# EAGLE design untitled (EAGLE 6.3)
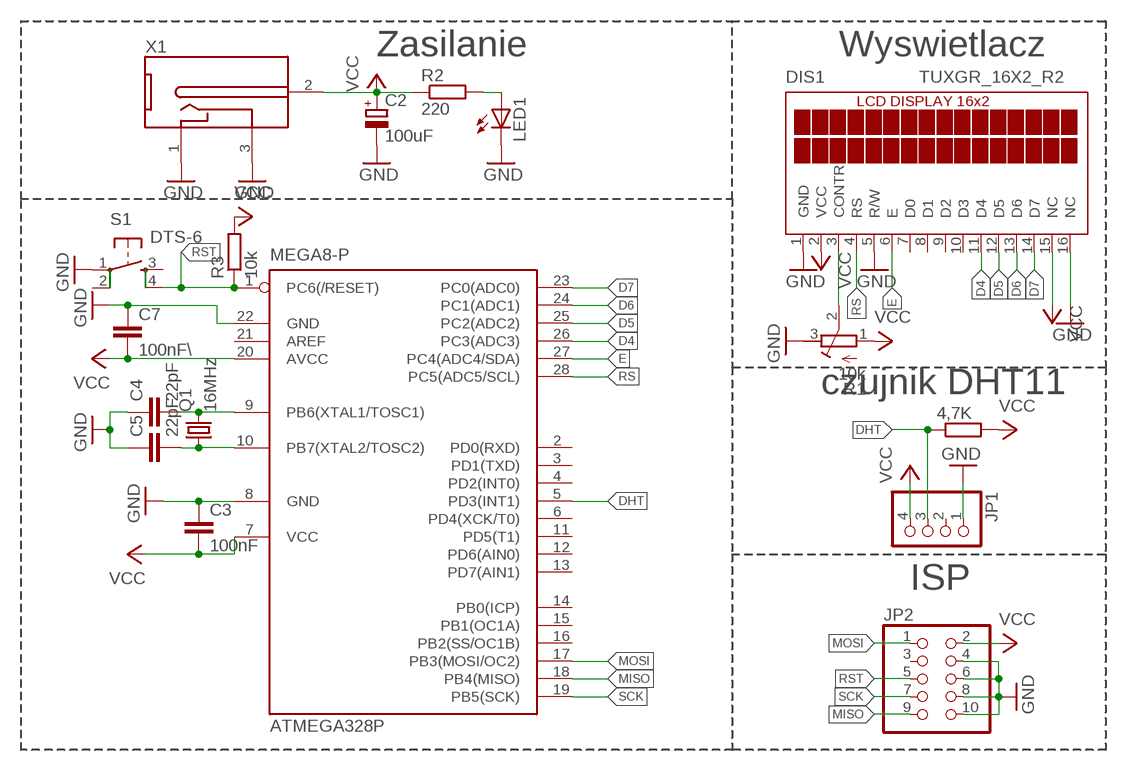
[diagram p0: schematic, sheet 1]

## Parts
4,7K  R-EU_0204/7  [0204/7]
ATMEGA328P  MEGA8-P  [DIL28-3]
C2  100uF  CPOL-EUE2.5-6  [E2,5-6]
C3  100nF  C-EU025-025X050  [C025-025X050]
C4  22pF  C-EU025-025X050  [C025-025X050]
C5  22pF  C-EU025-025X050  [C025-025X050]
C7  100nF\  C-EU025-025X050  [C025-025X050]
DIS1  TUXGR_16X2_R2  [TUXGR_16X2_R2]
JP1  PINHD-1X4  [1X04]
JP2  PINHD-2X5  [2X05]
LED1  LED3MM  [LED3MM]
Q1  16MHz  CRYSTALHC49S  [HC49/S]
R1  10k  R-TRIMM3339P  [RTRIM3339P]
R2  220  R-EU_0204/7  [0204/7]
R3  10k  R-EU_0204/7  [0204/7]
S1  DTS-6  [DTS-6]
X1  DC-2.1MM-5MM  [DC-21MM]

## Nets
D4: ATMEGA328P.26(PC3(ADC3)) DIS1.11(D4)
D5: ATMEGA328P.25(PC2(ADC2)) DIS1.12(D5)
D6: ATMEGA328P.24(PC1(ADC1)) DIS1.13(D6)
D7: ATMEGA328P.23(PC0(ADC0)) DIS1.14(D7)
DHT: 4,7K.1 ATMEGA328P.5(PD3(INT1)) JP1.3
E: ATMEGA328P.27(PC4(ADC4/SDA)) DIS1.6(E)
GND: ATMEGA328P.8(GND) ATMEGA328P.22(GND) C2.- C3.1 C4.1 C5.1 C7.1 DIS1.1(GND) DIS1.5(R/W) DIS1.16(NC) JP1.1 JP2.4 JP2.6 JP2.8 JP2.10 LED1.K(C) R1.3(A) S1.1 X1.1 X1.3
MISO: ATMEGA328P.18(PB4(MISO)) JP2.9
MOSI: ATMEGA328P.17(PB3(MOSI/OC2)) JP2.1
N$3: LED1.A R2.2
N$7: ATMEGA328P.10(PB7(XTAL2/TOSC2)) C5.2 Q1.1
N$8: ATMEGA328P.9(PB6(XTAL1/TOSC1)) C4.2 Q1.2
N$18: DIS1.3(CONTR) R1.2(S)
RS: ATMEGA328P.28(PC5(ADC5/SCL)) DIS1.4(RS)
RST: ATMEGA328P.1(PC6(/RESET)) JP2.5 R3.1 S1.4
SCK: ATMEGA328P.19(PB5(SCK)) JP2.7
VCC: 4,7K.2 ATMEGA328P.7(VCC) ATMEGA328P.20(AVCC) C2.+ C3.2 C7.2 DIS1.2(VCC) DIS1.15(NC) JP1.4 JP2.2 R1.1(E) R2.1 R3.2 X1.2
Unconnected: ATMEGA328P.2(PD0(RXD)) ATMEGA328P.3(PD1(TXD)) ATMEGA328P.4(PD2(INT0)) ATMEGA328P.6(PD4(XCK/T0)) ATMEGA328P.11(PD5(T1)) ATMEGA328P.12(PD6(AIN0)) ATMEGA328P.13(PD7(AIN1)) ATMEGA328P.14(PB0(ICP)) ATMEGA328P.15(PB1(OC1A)) ATMEGA328P.16(PB2(SS/OC1B)) ATMEGA328P.21(AREF) DIS1.7(D0) DIS1.8(D1) DIS1.9(D2) DIS1.10(D3) JP1.2 JP2.3 S1.2 S1.3

## Notes on the sheet
- Zasilanie | Wyswietlacz
- czujnik DHT11
- ISP

## Library data of the parts
4,7K R2 R3 = resistor:R-EU_: RESISTOR, European symbol
ATMEGA328P = atmel:MEGA8-P: MICROCONTROLLER 8 Kbytes FLASH, 1 kbytes SRAM, 512 bytes EEPROM, USART, 4-channel 10 bit ADC, 2-channel 8 bit ADC Pin compatible with Atmega48, ATMega88, ATMega168 Source: avr.lbr
C2 = resistor:CPOL-EU: POLARIZED CAPACITOR, European symbol
C3-C5 C7 = resistor:C-EU: CAPACITOR, European symbol
DIS1 = display-lcd:TUXGR_16X2_R2: Tuxgraphics LCD display 16x2 characters reflective, without background light Source: tuxgr_12x2_r2.pdf; OC_FARNELL: unknown; OC_NEWARK: unknown
JP1 = pinhead:PINHD-1X4: PIN HEADER
JP2 = pinhead:PINHD-2X5: PIN HEADER
LED1 = led:LED: LED OSRAM: - CHIPLED LG R971, LG N971, LY N971, LG Q971, LY Q971, LO R971, LY R971 LH N974, LH R974 LS Q976, LO Q976, LY Q976 LO Q996 - Hyper CHIPLED LW Q18S LB Q993, LB Q99A, LB R99A - SideLED LS A670, LO A670, LY A670, LG A670, LP A670 LB A673, LV A673, LT A673, LW A673 LH A674 LY A675 LS A676, LA A676, LO A676, LY A676, LW A676 LS A679, LY A679, LG A679 - Hyper Micro SIDELED® LS Y876, LA Y876, LO Y876, LY Y876 LT Y87S - SmartLED LW L88C, LW L88S LB L89C, LB L89S, LG L890 LS L89K, LO L89K, LY L89K LS L896, LA L896, LO L896, LY L896 - TOPLED LS T670, LO T670, LY T670, LG T670, LP T670 LSG T670, LSP T670, LSY T670, LOP T670, LYG T670 LG T671, LOG T671, LSG T671 LB T673, LV T673, LT T673, LW T673 LH T674 LS T676, LA T676, LO T676, LY T676, LB T676, LH T676, LSB T676, LW T676 LB T67C, LV T67C, LT T67C, LS T67K, LO T67K, LY T67K, LW E67C LS E67B, LA E67B, LO E67B, LY E67B, LB E67C, LV E67C, LT E67C LW T67C LS T679, LY T679, LG T679 LS T770, LO T770, LY T770, LG T770, LP T770 LB T773, LV T773, LT T773, LW T773 LH T774 LS E675, LA E675, LY E675, LS T675 LS T776, LA T776, LO T776, LY T776, LB T776 LHGB T686 LT T68C, LB T68C - Hyper Mini TOPLED® LB M676 - Mini TOPLED Santana® LG M470 LS M47K, LO M47K, LY M47K Source: http://www.osram.convergy.de LUXEON: - LUMILED® LXK2-PW12-R00, LXK2-PW12-S00, LXK2-PW14-U00, LXK2-PW14-V00 LXK2-PM12-R00, LXK2-PM12-S00, LXK2-PM14-U00 LXK2-PE12-Q00, LXK2-PE12-R00, LXK2-PE12-S00, LXK2-PE14-T00, LXK2-PE14-U00 LXK2-PB12-K00, LXK2-PB12-L00, LXK2-PB12-M00, LXK2-PB14-N00, LXK2-PB14-P00, LXK2-PB14-Q00 LXK2-PR12-L00, LXK2-PR12-M00, LXK2-PR14-Q00, LXK2-PR14-R00 LXK2-PD12-Q00, LXK2-PD12-R00, LXK2-PD12-S00 LXK2-PH12-R00, LXK2-PH12-S00 LXK2-PL12-P00, LXK2-PL12-Q00, LXK2-PL12-R00 Source: www.luxeon.com KINGBRIGHT: KA-3528ASYC Source: www.kingbright.com
Q1 = crystal:CRYSTAL: CRYSTAL; OC_FARNELL: 1667008; OC_NEWARK: unknown
R1 = resistor:R-TRIMM: Trimm resistor
S1 = switch-tact:DTS-6
X1 = power-jack:DC: 5mm x 2.1mm jack

## Board
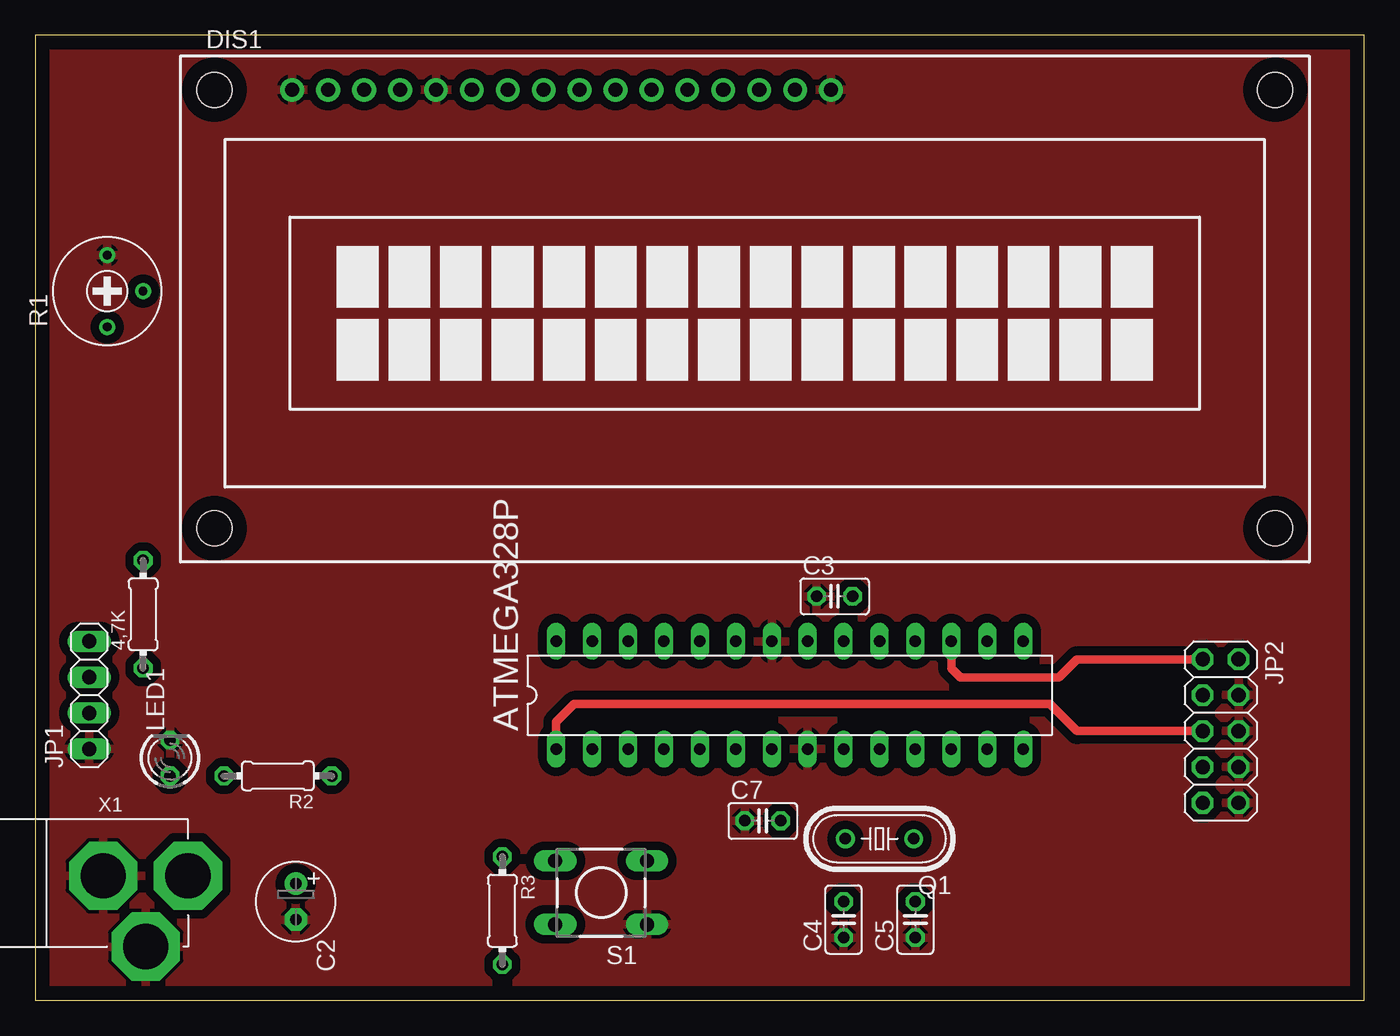
[diagram p1: board, top side]
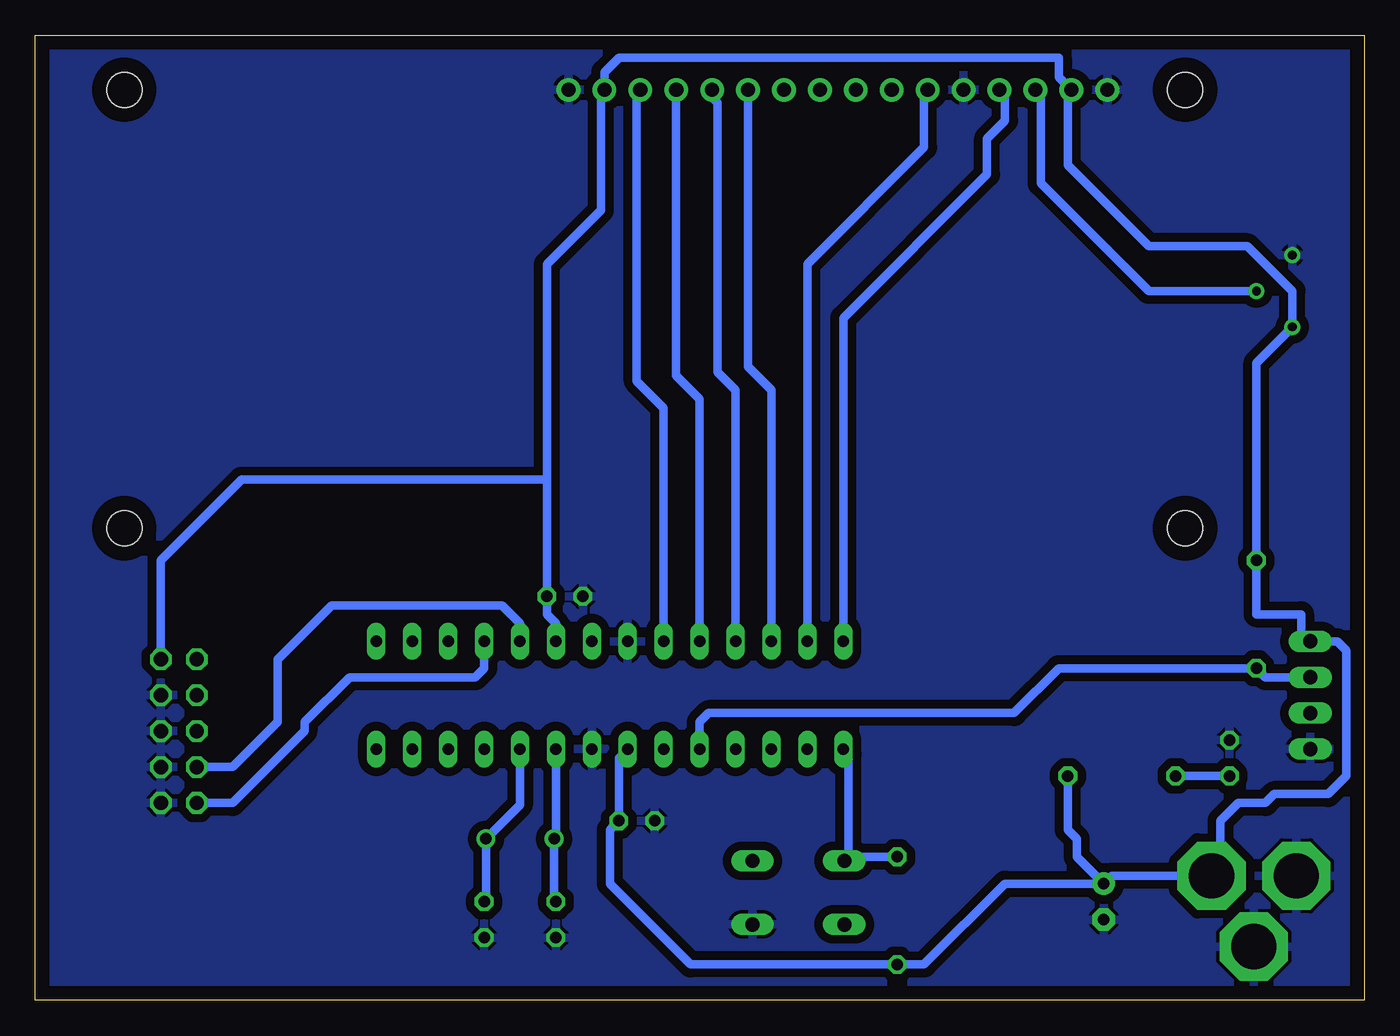
[diagram p2: board, bottom side, seen from below]

Size 93.96 x 68.25 mm. Coordinates in mm from the lower left corner, seen from the top.
Outline: 0,0 93.96,0 93.96,68.25 0,68.25 0,0
Copper layers (1*16): Top 0.035mm / dielectric 1.5mm / Bottom 0.035mm
Design rules "default": minimum track width 10mil, minimum drill 24mil, track to track 8mil, track to pad 8mil, pad to pad 8mil, via to via 8mil, smd to smd 8mil, copper to edge 40mil, drill to drill 8mil, minimum pad ring 10mil, minimum via ring 8mil, stop-mask expansion 4mil, vias tented up to drill 0mil, thermal gap 10mil

### Footprints (pad centres in the part's own frame; a part is rotated, then mirrored left to right if it is on the bottom)
0204/7 = drill 0.813 octagon: 1 -3.81,0; 2 3.81,0
DIL28-3 = drill 0.813 long: 1 -16.51,-3.81; 2 -13.97,-3.81; 3 -11.43,-3.81; 4 -8.89,-3.81; 5 -6.35,-3.81; 6 -3.81,-3.81; 7 -1.27,-3.81; 8 1.27,-3.81; 9 3.81,-3.81; 10 6.35,-3.81; 11 8.89,-3.81; 12 11.43,-3.81; 13 13.97,-3.81; 14 16.51,-3.81; 15 16.51,3.81; 16 13.97,3.81; 17 11.43,3.81; 18 8.89,3.81; 19 6.35,3.81; 20 3.81,3.81; 21 1.27,3.81; 22 -1.27,3.81; 23 -3.81,3.81; 24 -6.35,3.81; 25 -8.89,3.81; 26 -11.43,3.81; 27 -13.97,3.81; 28 -16.51,3.81
E2,5-6 = drill 0.813 pad 1.6: + -1.27,0 | drill 0.813 pad 1.6 octagon: - 1.27,0
C025-025X050 = drill 0.813 octagon: 1 -1.27,0; 2 1.27,0
TUXGR_16X2_R2 = drill 1 pad 1.676: 1 -32,15.5; 2 -29.46,15.5; 3 -26.92,15.5; 4 -24.38,15.5; 5 -21.84,15.5; 6 -19.3,15.5; 7 -16.76,15.5; 8 -14.22,15.5; 9 -11.68,15.5; 10 -9.14,15.5; 11 -6.6,15.5; 12 -4.06,15.5; 13 -1.52,15.5; 14 1.02,15.5; 15 3.56,15.5; 16 6.1,15.5 | hole 2.5: -37.5,-15.5; 37.5,-15.5; -37.5,15.5; 37.5,15.5
1X04 = drill 1.016 long: 1 -3.81,0; 2 -1.27,0; 3 1.27,0; 4 3.81,0
2X05 = drill 1.016 octagon: 1 -5.08,-1.27; 2 -5.08,1.27; 3 -2.54,-1.27; 4 -2.54,1.27; 5 0,-1.27; 6 0,1.27; 7 2.54,-1.27; 8 2.54,1.27; 9 5.08,-1.27; 10 5.08,1.27
LED3MM = drill 0.813 octagon: A -1.27,0; K 1.27,0
HC49/S = drill 0.813: 1 -2.413,0; 2 2.413,0
RTRIM3339P = drill 0.61: 1 -2.54,0; 2 0,-2.54; 3 2.54,0
DTS-6 = drill 1 long: 1 -3.25,2.25; 2 3.25,2.25; 3 -3.25,-2.25; 4 3.25,-2.25
DC-21MM = drill 3.2 pad 4.826 octagon: 1 -5.08,-3.353; 2 -0.076,-6.35; 3 -0.076,-0.356

### Placement (x,y rotation side)
4,7K  7.62,27.3 90 top
ATMEGA328P  53.34,21.59 0 top
C2  18.41,6.99 270 top
C3  56.52,28.57 0 top
C4  57.15,5.71 90 top
C5  62.23,5.71 90 top
C7  51.44,12.7 0 top
DIS1  50.16,48.9 0 top
JP1  3.81,21.59 90 top
JP2  83.82,19.05 270 top
LED1  9.53,17.14 90 top
Q1  59.69,11.43 180 top
R1  5.08,50.16 90 top
R2  17.14,15.88 180 top
R3  33.02,6.35 270 top
S1  40.01,7.62 180 top
X1  4.45,8.89 90 top

### Tracks (layer width: path | path; a pad name or v marks a point on that pad's centre or on a via)
D4
  Bottom 0.61: DIS1.11 43.56,44.84 41.91,43.18 ATMEGA328P.26 41.91,24.77
D5
  Bottom 0.61: ATMEGA328P.25 44.45,43.18 45.72,44.45 45.72,63.5 46.35,64.14 DIS1.12
D6
  Bottom 0.61: DIS1.13 48.65,44.2 46.99,42.55 ATMEGA328P.24
D7
  Bottom 0.61: ATMEGA328P.23 49.53,41.91 51.44,43.81 51.44,64.14 DIS1.14
DHT
  Bottom 0.61: JP1.3 6.99,22.86 4,7K.1 21.59,23.5 24.77,20.32 46.35,20.32 46.99,19.68 ATMEGA328P.5
E
  Bottom 0.61: ATMEGA328P.27 39.37,52.07 31.11,60.33 31.11,64.14 DIS1.6
GND
  pour Top (isolate 0.61): -3.17,70.48 97.16,70.48 97.16,-2.54 -3.17,-2.54
  pour Bottom (isolate 0.61): -1.91,69.22 95.25,69.22 95.25,-1.91 -1.91,-1.91 -1.91,68.58
MISO
  Bottom 0.61: ATMEGA328P.18 62.23,23.5 62.87,22.86 71.75,22.86 74.93,19.68 74.93,19.05 80.01,13.97 JP2.9
MOSI
  Top 0.61: JP2.1 73.66,24.13 72.39,22.86 65.41,22.86 64.77,23.5 ATMEGA328P.17
N$3
  Bottom 0.61: R2.2 LED1.A
N$7
  Bottom 0.61: ATMEGA328P.10 59.69,13.84 Q1.1 62.1,7.11 C5.2
N$8
  Bottom 0.61: ATMEGA328P.9 57.15,11.56 Q1.2 57.28,7.11 C4.2
N$18
  Bottom 0.61: R1.2 15.24,50.16 22.86,57.78 22.86,64.01 DIS1.3
RS
  Bottom 0.61: ATMEGA328P.28 36.83,48.26 26.67,58.42 26.67,60.96 25.4,62.23 25.4,64.01 DIS1.4
RST
  Top 0.61: JP2.5 73.66,19.05 71.75,20.95 38.1,20.95 36.83,19.68 ATMEGA328P.1
  Bottom 0.61: R3.1 36.47,10.16 | 36.47,10.16 S1.4 | 36.47,10.16 36.47,17.41 ATMEGA328P.1
SCK
  Bottom 0.61: ATMEGA328P.19 59.69,26.67 60.96,27.94 73.03,27.94 76.83,24.13 76.83,19.68 80.01,16.51 JP2.7
VCC
  Bottom 0.61: C2.+ 17.86,8.81 X1.2 10.16,9.45 10.16,12.7 8.89,13.97 6.99,13.97 6.35,14.61 2.54,14.61 1.27,15.88 1.27,24.77 1.91,25.4 JP1.4 4.45,26.04 4.45,27.3 7.62,27.3 4,7K.2 7.62,45.09 R1.1 5.08,50.16 8.26,53.34 15.24,53.34 20.95,59.05 20.95,64.14 DIS1.2 21.59,65.28 21.59,66.67 52.7,66.67 53.73,65.66 DIS1.15 53.98,64.14 53.98,55.88 57.78,52.07 57.78,36.83 | C2.+ 20.32,10.16 20.32,11.43 20.95,12.06 R2.1 | C2.+ 25.4,8.26 31.11,2.54 R3.2 47.62,2.54 53.34,8.26 53.34,12.06 C7.2 52.7,17.14 ATMEGA328P.7 | 57.78,36.83 C3.2 57.78,27.3 57.15,26.67 ATMEGA328P.20 | JP2.2 85.09,31.11 79.38,36.83 57.78,36.83